# EAGLE design linSen (EAGLE 6.2)
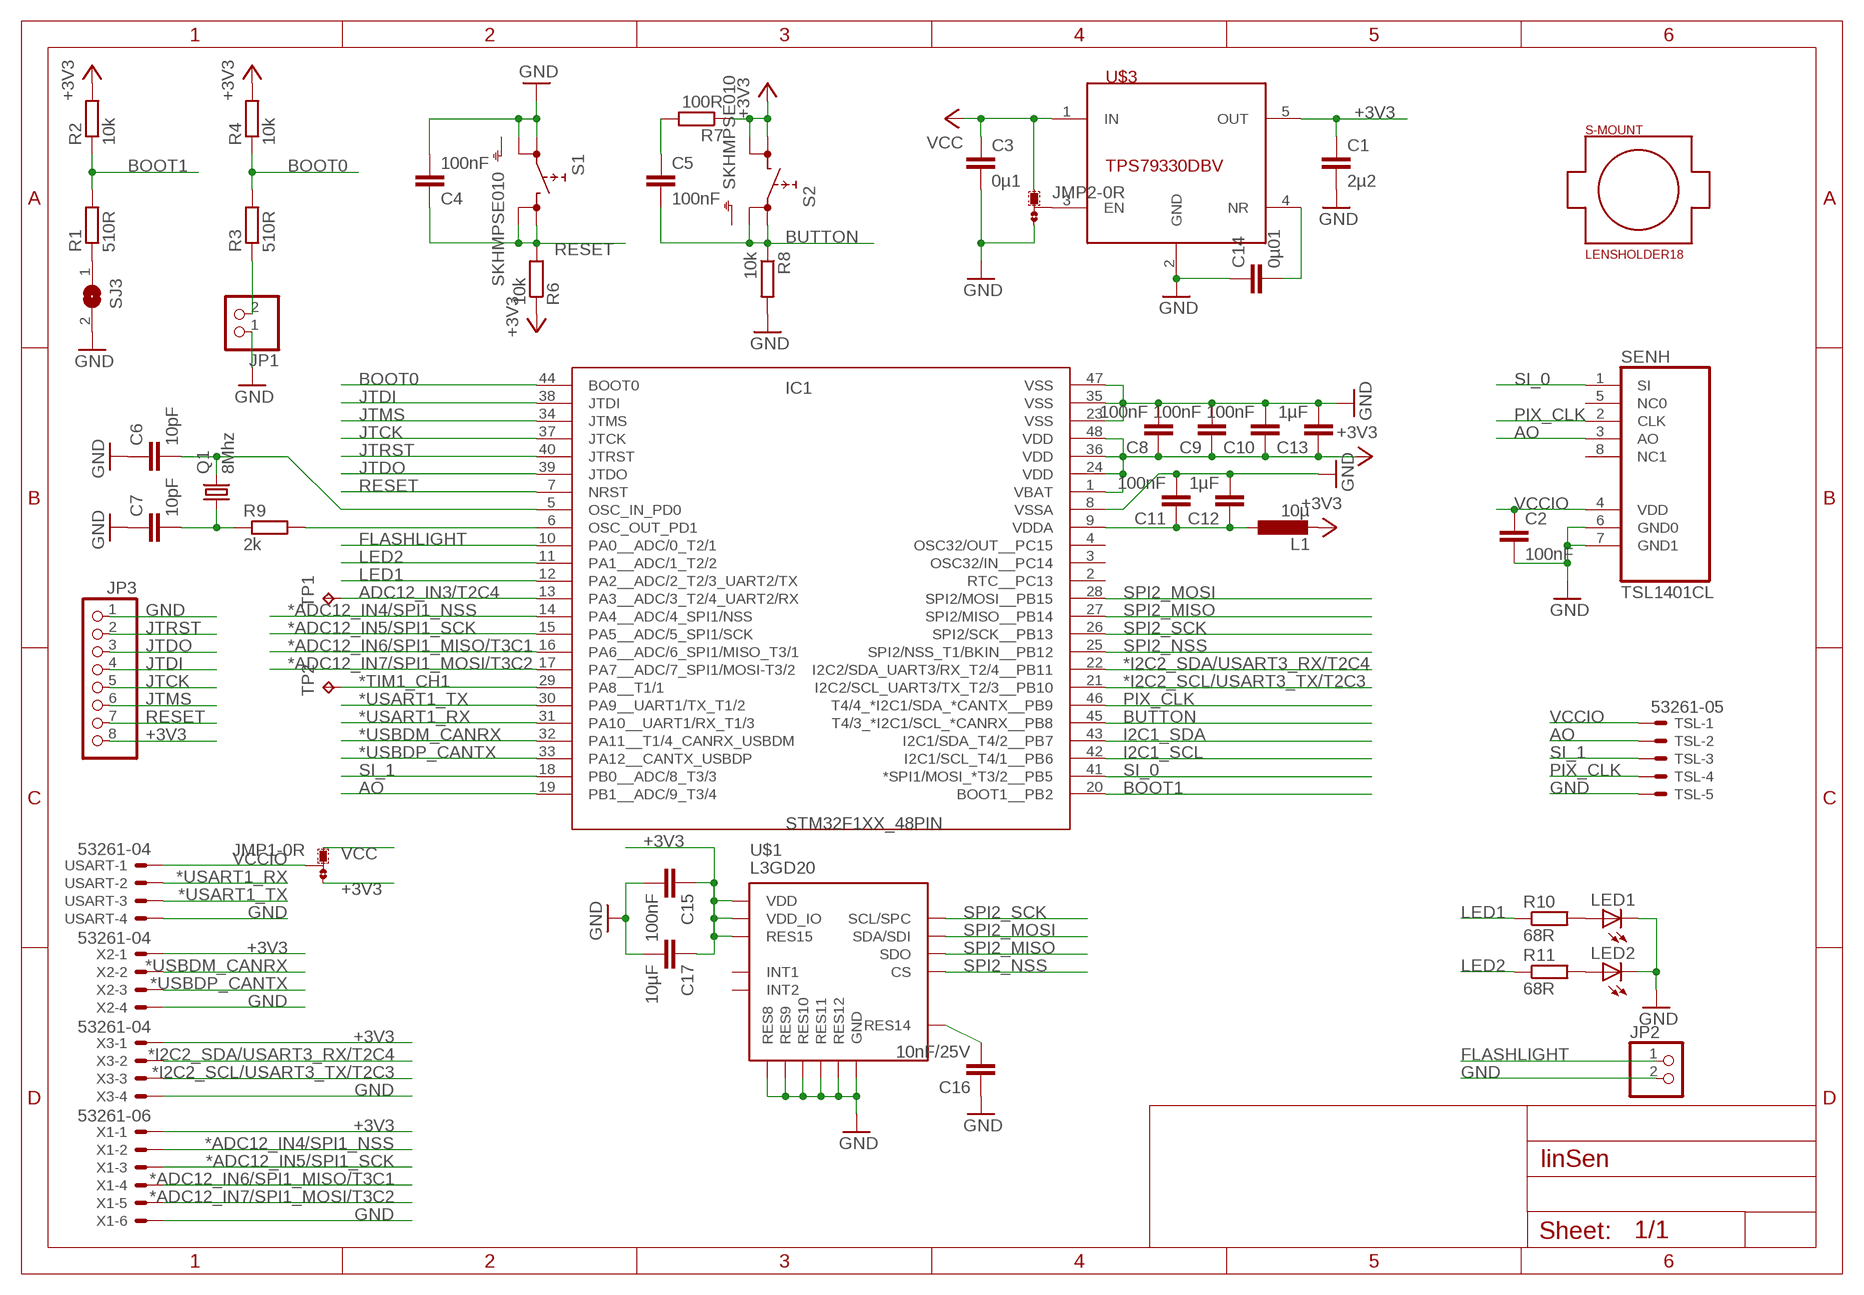
[diagram p0: schematic, sheet 1]

## Parts
C1  2µ2  C-EUC0805  [C0805]
C2  100nF  C-EUC0603  [C0603]
C3  0µ1  C-EUC0603  [C0603]
C4  100nF  C-EUC0603  [C0603]
C5  100nF  C-EUC0603  [C0603]
C6  10pF  C-EUC0603  [C0603]
C7  10pF  C-EUC0603  [C0603]
C8  100nF  C-EUC0603  [C0603]
C9  100nF  C-EUC0603  [C0603]
C10  100nF  C-EUC0603  [C0603]
C11  100nF  C-EUC0603  [C0603]
C12  1µF  C-EUC0603  [C0603]
C13  1µF  C-EUC0603  [C0603]
C14  0µ01  C-EUC0603  [C0603]
C15  100nF  C-EUC0603  [C0603]
C16  10nF/25V  C-EUC0603  [C0603]
C17  10µF  C-EUC0603  [C0603]
IC1  STM32F1XX_48PIN  [LQFP48_PACKAGE]
JMP1  0R-JUMPB  [B0R-JMP]
JMP2  0R-JUMPB  [B0R-JMP]
JP1  PINHD-1X2/90  [1X02/90]
JP2  PINHD-1X2  [1X02]
JP3  PINHD-1X8/SMD  [SMD-PAD-08]
L1  10µ  L-EUL2012C  [L2012C]
LED1  LEDCHIPLED_0603  [CHIPLED_0603]
LED2  LEDCHIPLED_0603  [CHIPLED_0603]
Q1  8Mhz  CRYSTALSM49  [SM49]
R1  510R  R-EU_R0603  [R0603]
R2  10k  R-EU_R0603  [R0603]
R3  510R  R-EU_R0603  [R0603]
R4  10k  R-EU_R0603  [R0603]
R6  10k  R-EU_R0603  [R0603]
R7  100R  R-EU_R0603  [R0603]
R8  10k  R-EU_R0603  [R0603]
R9  2k  R-EU_R0603  [R0603]
R10  68R  R-EU_R0603  [R0603]
R11  68R  R-EU_R0603  [R0603]
S1  SKHMPSE010  [SKHMPXE010]
S2  SKHMPSE010  [SKHMPXE010]
S-MOUNT  LENSHOLDER18  [SMOUNT18]
SENH  TSL1401CL  [TSL1401CL]
SJ3  SJ  [SJ]
TP1  TPB1,27  [B1,27]
TP2  TPB1,27  [B1,27]
TSL  53261-05  [53261-05]
U$1  L3GD20  [LGA-16]
U$3  TPS79330DBV  TPS793XXDBV  [SOT23-5]
USART  53261-04  [53261-04]
X1  53261-06  [53261-06]
X2  53261-04  [53261-04]
X3  53261-04  [53261-04]

## Nets
*ADC12_IN4/SPI1_NSS: IC1.14(PA4__ADC/4_SPI1/NSS) X1.2
*ADC12_IN5/SPI1_SCK: IC1.15(PA5__ADC/5_SPI1/SCK) X1.3
*ADC12_IN6/SPI1_MISO/T3C1: IC1.16(PA6__ADC/6_SPI1/MISO_T3/1) X1.4
*ADC12_IN7/SPI1_MOSI/T3C2: IC1.17(PA7__ADC/7_SPI1/MOSI-T3/2) X1.5
*I2C2_SCL/USART3_TX/T2C3: IC1.21(I2C2/SCL_UART3/TX_T2/3__PB10) X3.3
*I2C2_SDA/USART3_RX/T2C4: IC1.22(I2C2/SDA_UART3/RX_T2/4__PB11) X3.2
*TIM1_CH1: IC1.29(PA8__T1/1) TP2.TP
*USART1_RX: IC1.31(PA10__UART1/RX_T1/3) USART.2
*USART1_TX: IC1.30(PA9__UART1/TX_T1/2) USART.3
*USBDM_CANRX: IC1.32(PA11__T1/4_CANRX_USBDM) X2.2
*USBDP_CANTX: IC1.33(PA12__CANTX_USBDP) X2.3
+3V3: C1.1 C8.1 C9.1 C10.1 C13.1 C15.1 C17.1 IC1.1(VBAT) IC1.24(VDD) IC1.36(VDD) IC1.48(VDD) JMP1.3 JP3.8 L1.2 R2.2 R4.2 R6.1 R7.1 S2.3(2.1) S2.4(2.2) U$1.P$1(VDD_IO) U$1.P$15(RES15) U$1.P$16(VDD) U$3.5(OUT) X1.1 X2.1 X3.1
ADC12_IN3/T2C4: IC1.13(PA3__ADC/3_T2/4_UART2/RX) TP1.TP
AO: IC1.19(PB1__ADC/9_T3/4) SENH.3(AO) TSL.2
BOOT0: IC1.44(BOOT0) R3.2 R4.1
BOOT1: IC1.20(BOOT1__PB2) R1.2 R2.1
BUTTON: C5.2 IC1.45(T4/3_*I2C1/SCL_*CANRX__PB8) R8.1 S2.1(1.1) S2.2(1.2)
FLASHLIGHT: IC1.10(PA0__ADC/0_T2/1) JP2.1
GND: C1.2 C2.2 C3.2 C4.2 C6.1 C7.1 C8.2 C9.2 C10.2 C11.2 C12.2 C13.2 C14.1 C15.2 C16.1 C17.2 IC1.8(VSSA) IC1.23(VSS) IC1.35(VSS) IC1.47(VSS) JMP2.3 JP1.1 JP2.2 JP3.1 LED1.C LED2.C R8.2 S1.1(1.1) S1.2(1.2) SENH.6(GND0) SENH.7(GND1) SJ3.2 TSL.5 U$1.P$8(RES8) U$1.P$9(RES9) U$1.P$10(RES10) U$1.P$11(RES11) U$1.P$12(RES12) U$1.P$13(GND) U$3.2(GND) USART.4 X1.6 X2.4 X3.4
I2C1_SCL: IC1.42(I2C1/SCL_T4/1__PB6)
I2C1_SDA: IC1.43(I2C1/SDA_T4/2__PB7)
JTCK: IC1.37(JTCK) JP3.5
JTDI: IC1.38(JTDI) JP3.4
JTDO: IC1.39(JTDO) JP3.3
JTMS: IC1.34(JTMS) JP3.6
JTRST: IC1.40(JTRST) JP3.2
LED1: IC1.12(PA2__ADC/2_T2/3_UART2/TX) R10.1
LED2: IC1.11(PA1__ADC/1_T2/2) R11.1
N$1: JP1.2 R3.1
N$2: R1.1 SJ3.1
N$3: C6.2 IC1.5(OSC_IN_PD0) Q1.2
N$4: C16.2 U$1.P$14(RES14)
N$5: C7.2 Q1.1 R9.1
N$6: C5.1 R7.2
N$7: IC1.6(OSC_OUT_PD1) R9.2
N$9: C14.2 U$3.4(NR)
N$10: JMP2.2 U$3.3(EN)
N$11: C11.1 C12.1 IC1.9(VDDA) L1.1
N$12: LED1.A R10.2
N$13: LED2.A R11.2
PIX_CLK: IC1.46(T4/4_*I2C1/SDA_*CANTX__PB9) SENH.2(CLK) TSL.4
RESET: C4.1 IC1.7(NRST) JP3.7 R6.2 S1.3(2.1) S1.4(2.2)
SI_0: IC1.41(*SPI1/MOSI_*T3/2__PB5) SENH.1(SI)
SI_1: IC1.18(PB0__ADC/8_T3/3) TSL.3
SPI2_MISO: IC1.27(SPI2/MISO__PB14) U$1.P$4(SDO)
SPI2_MOSI: IC1.28(SPI2/MOSI__PB15) U$1.P$3(SDA/SDI)
SPI2_NSS: IC1.25(SPI2/NSS_T1/BKIN__PB12) U$1.P$5(CS)
SPI2_SCK: IC1.26(SPI2/SCK__PB13) U$1.P$2(SCL/SPC)
VCC: C3.1 JMP1.1 JMP2.1 U$3.1(IN)
VCCIO: C2.1 JMP1.2 SENH.4(VDD) TSL.1 USART.1
Unconnected: IC1.2(RTC__PC13) IC1.3(OSC32/IN__PC14) IC1.4(OSC32/OUT__PC15) S1.5(SH) S2.5(SH) SENH.5(NC0) SENH.8(NC1) U$1.P$6(INT2) U$1.P$7(INT1)

## Library data of the parts
C1-C17 = rcl:C-EU: CAPACITOR, European symbol
IC1 = unsorted:STM32F1XX_48PIN: STM32F1_Low_Med_density_value_LQFP48 edit this description Auto generated by make-symbol-device-package-bsdl.ulp Rev. 32 Source: STM32F1_Low_Med_density_value_LQFP48.bsd
JMP1 JMP2 = jump-0r-smd:0R-JUMP: SMD 0R 0805 Jumper
JP1 JP2 = pinhead:PINHD-1X2: PIN HEADER
JP3 = unsorted:PINHD-1X8: PIN HEADER
L1 = rcl:L-EU: INDUCTOR, European symbol
LED1 LED2 = led:LED: LED OSRAM: - CHIPLED LG R971, LG N971, LY N971, LG Q971, LY Q971, LO R971, LY R971 LH N974, LH R974 LS Q976, LO Q976, LY Q976 LO Q996 - Hyper CHIPLED LW Q18S LB Q993, LB Q99A, LB R99A - SideLED LS A670, LO A670, LY A670, LG A670, LP A670 LB A673, LV A673, LT A673, LW A673 LH A674 LY A675 LS A676, LA A676, LO A676, LY A676, LW A676 LS A679, LY A679, LG A679 - Hyper Micro SIDELED® LS Y876, LA Y876, LO Y876, LY Y876 LT Y87S - SmartLED LW L88C, LW L88S LB L89C, LB L89S, LG L890 LS L89K, LO L89K, LY L89K LS L896, LA L896, LO L896, LY L896 - TOPLED LS T670, LO T670, LY T670, LG T670, LP T670 LSG T670, LSP T670, LSY T670, LOP T670, LYG T670 LG T671, LOG T671, LSG T671 LB T673, LV T673, LT T673, LW T673 LH T674 LS T676, LA T676, LO T676, LY T676, LB T676, LH T676, LSB T676, LW T676 LB T67C, LV T67C, LT T67C, LS T67K, LO T67K, LY T67K, LW E67C LS E67B, LA E67B, LO E67B, LY E67B, LB E67C, LV E67C, LT E67C LW T67C LS T679, LY T679, LG T679 LS T770, LO T770, LY T770, LG T770, LP T770 LB T773, LV T773, LT T773, LW T773 LH T774 LS E675, LA E675, LY E675, LS T675 LS T776, LA T776, LO T776, LY T776, LB T776 LHGB T686 LT T68C, LB T68C - Hyper Mini TOPLED® LB M676 - Mini TOPLED Santana® LG M470 LS M47K, LO M47K, LY M47K Source: http://www.osram.convergy.de LUXEON: - LUMILED® LXK2-PW12-R00, LXK2-PW12-S00, LXK2-PW14-U00, LXK2-PW14-V00 LXK2-PM12-R00, LXK2-PM12-S00, LXK2-PM14-U00 LXK2-PE12-Q00, LXK2-PE12-R00, LXK2-PE12-S00, LXK2-PE14-T00, LXK2-PE14-U00 LXK2-PB12-K00, LXK2-PB12-L00, LXK2-PB12-M00, LXK2-PB14-N00, LXK2-PB14-P00, LXK2-PB14-Q00 LXK2-PR12-L00, LXK2-PR12-M00, LXK2-PR14-Q00, LXK2-PR14-R00 LXK2-PD12-Q00, LXK2-PD12-R00, LXK2-PD12-S00 LXK2-PH12-R00, LXK2-PH12-S00 LXK2-PL12-P00, LXK2-PL12-Q00, LXK2-PL12-R00 Source: www.luxeon.com KINGBRIGHT: KA-3528ASYC Source: www.kingbright.com
Q1 = crystal:CRYSTAL: CRYSTAL; OC_FARNELL: unknown; OC_NEWARK: unknown
R1-R4 R6-R11 = rcl:R-EU_: RESISTOR, European symbol
S1 S2 = switch:SKHMP*E010: 6.2 X 6.5mm TACT Switch (SMD) Source: http://www3.alps.co.jp/WebObjects/catalog.woa/PDF/E/Switch/Tact/SKHM/SKHM.PDF
S-MOUNT = unsorted:LENSHOLDER: S-mount lensholder 12x0.5
SENH = unsorted:TSL1401CL: 128 × 1 LINEAR SENSOR ARRAY WITH HOLD
SJ3 = jumper:SJ: SMD solder JUMPER
TP1 TP2 = testpad:TP: Test pad
TSL = con-molex:53?-05: CONNECTOR wire to board 1.25 mm (.049 inch) pitch header; OC_FARNELL: 1433644; OC_NEWARK: unknown
U$1 = imu:L3GD20: MEMS motion sensor: three-axis digital output gyroscope
U$3 = pwr:TPS793XX: ULTRALOW-NOISE, HIGH PSRR, FAST RF 200mA LOW-DROPOUT LINEAR REGULATORS IN NanoStarTM WAFER CHIP SCALE AND SOT23
USART X2 X3 = con-molex:53?-04: CONNECTOR wire to board 1.25 mm (.049 inch) pitch header; OC_FARNELL: 1125374; OC_NEWARK: unknown
X1 = con-molex:53?-06: CONNECTOR wire to board 1.25 mm (.049 inch) pitch header; OC_FARNELL: 1125375; OC_NEWARK: unknown

## Board
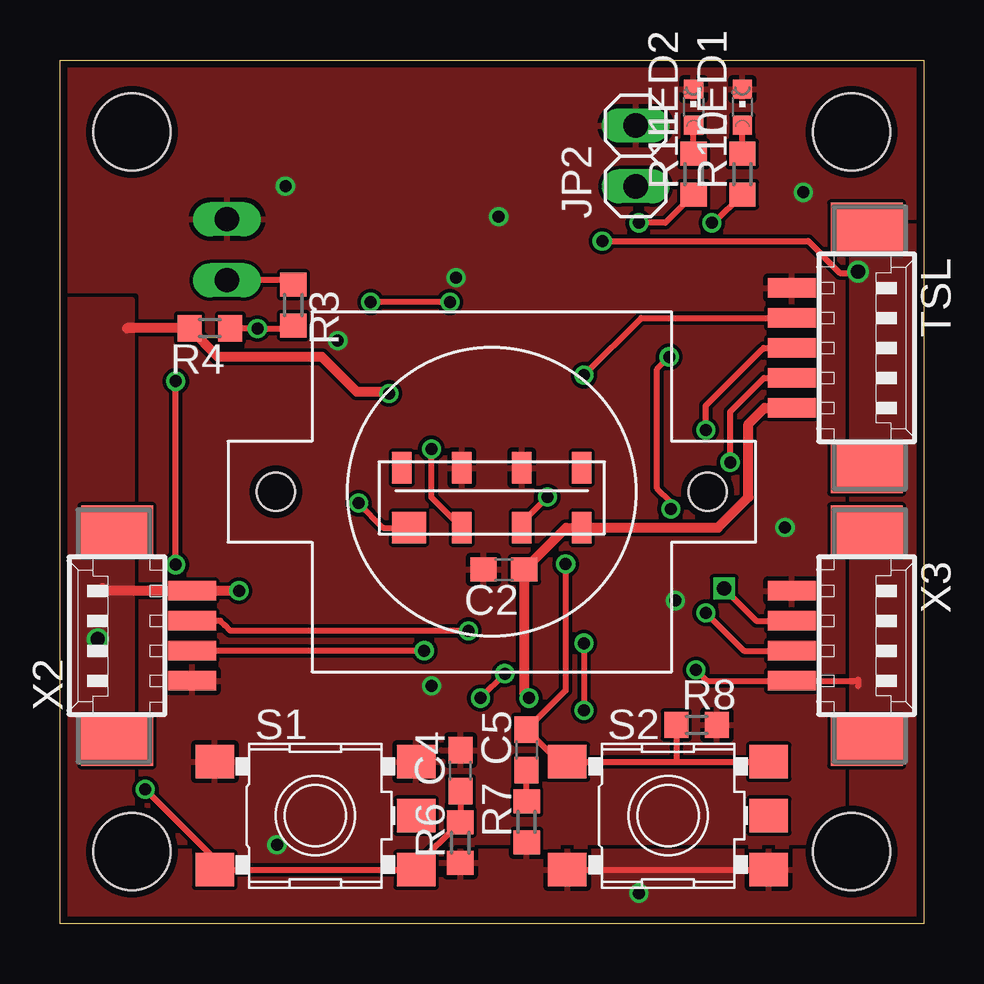
[diagram p1: board, top side]
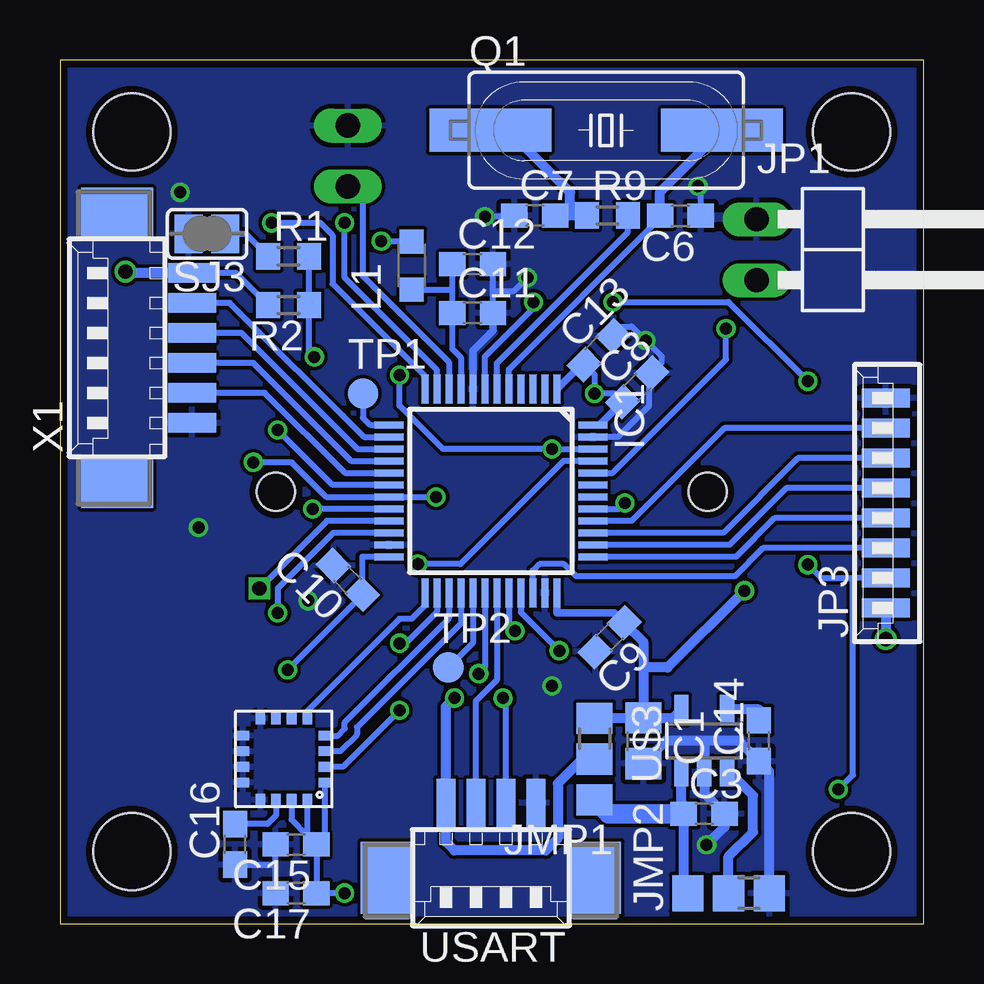
[diagram p2: board, bottom side, seen from below]

Size 36 x 36 mm. Coordinates in mm from the lower left corner, seen from the top.
Outline: 0,36 36,36 36,0 0,0 0,36
Copper layers (1*16): Top 0.035mm / dielectric 1.5mm / Bottom 0.035mm
Design rules: minimum track width 0.15mm, minimum drill 0.3mm, track to track 0.15mm, track to pad 0.15mm, pad to pad 0.15mm, via to via 0.15mm, smd to smd 0.15mm, copper to edge 0.3mm, drill to drill 0.2mm, minimum pad ring 0.2mm, minimum via ring 0.15mm, stop-mask expansion 0.075mm, vias tented up to drill 0mil, thermal gap 0.2mm
Holes 3.2 mm at 3,33 3,3 33,33 33,3

### Footprints (pad centres in the part's own frame; a part is rotated, then mirrored left to right if it is on the bottom)
C0805 = smd 1.3 x 1.5: 1 -0.95,0; 2 0.95,0
C0603 = smd 1.1 x 1: 1 -0.85,0; 2 0.85,0
LQFP48_PACKAGE = smd 1.2 x 0.3: 1 -4.25,2.75; 2 -4.25,2.25; 3 -4.25,1.75; 4 -4.25,1.25; 5 -4.25,0.75; 6 -4.25,0.25; 7 -4.25,-0.25; 8 -4.25,-0.75; 9 -4.25,-1.25; 10 -4.25,-1.75; 11 -4.25,-2.25; 12 -4.25,-2.75; 25 4.25,-2.75; 26 4.25,-2.25; 27 4.25,-1.75; 28 4.25,-1.25; 29 4.25,-0.75; 30 4.25,-0.25; 31 4.25,0.25; 32 4.25,0.75; 33 4.25,1.25; 34 4.25,1.75; 35 4.25,2.25; 36 4.25,2.75 | smd 0.3 x 1.2: 13 -2.75,-4.25; 14 -2.25,-4.25; 15 -1.75,-4.25; 16 -1.25,-4.25; 17 -0.75,-4.25; 18 -0.25,-4.25; 19 0.25,-4.25; 20 0.75,-4.25; 21 1.25,-4.25; 22 1.75,-4.25; 23 2.25,-4.25; 24 2.75,-4.25; 37 2.75,4.25; 38 2.25,4.25; 39 1.75,4.25; 40 1.25,4.25; 41 0.75,4.25; 42 0.25,4.25; 43 -0.25,4.25; 44 -0.75,4.25; 45 -1.25,4.25; 46 -1.75,4.25; 47 -2.25,4.25; 48 -2.75,4.25
B0R-JMP = smd 1.5 x 1.3: 1 0,1.7; 2 0,0; 3 0,-1.7
1X02/90 = drill 1.016 long: 1 -1.27,-3.81; 2 1.27,-3.81
1X02 = drill 1.016 long: 1 -1.27,0; 2 1.27,0
SMD-PAD-08 = smd 0.8 x 2: 1 4.375,-2.5; 2 3.125,-2.5; 3 1.875,-2.5; 4 0.625,-2.5; 5 -0.625,-2.5; 6 -1.875,-2.5; 7 -3.125,-2.5; 8 -4.375,-2.5
L2012C = smd 1 x 1: 1 -1,0; 2 1,0
CHIPLED_0603 = smd 0.8 x 0.8: A 0,-0.75; C 0,0.75
SM49 = smd 5.08 x 1.778: 1 -4.826,0; 2 4.826,0
R0603 = smd 1 x 1.1: 1 -0.85,0; 2 0.85,0
SKHMPXE010 = smd 1.6 x 1.4: 1 -4.2,2.25; 2 4.2,2.25; 3 -4.2,-2.25; 4 4.2,-2.25; 5 4.2,0
SMOUNT18 = hole 1.6: -9,0; 9,0
TSL1401CL = smd 1.3 x 1.4: 1 -1.25,3.45 | smd 1.3 x 0.8: 2 -1.25,1.25; 3 -1.25,-1.25; 4 -1.25,-3.75; 5 1.25,-3.75; 6 1.25,-1.25; 7 1.25,1.25; 8 1.25,3.75
SJ = smd 1.168 x 1.6: 1 -0.762,0; 2 0.762,0
B1,27 = smd 1.27 x 1.27: TP 0,0
53261-05 = smd 0.8 x 2: 1 2.5,-2.5; 2 1.25,-2.5; 3 0,-2.5; 4 -1.25,-2.5; 5 -2.5,-2.5 | smd 2.1 x 3: S1 5,0.625; S2 -5,0.625
LGA-16 = smd 0.5 x 0.4: P$1 -1.7,0.975; P$2 -1.7,0.325; P$3 -1.7,-0.325; P$4 -1.7,-0.975; P$9 1.7,-0.975; P$10 1.7,-0.325; P$11 1.7,0.325; P$12 1.7,0.975 | smd 0.4 x 0.5: P$5 -0.975,-1.7; P$6 -0.325,-1.7; P$7 0.325,-1.7; P$8 0.975,-1.7; P$13 0.975,1.7; P$14 0.325,1.7; P$15 -0.325,1.7; P$16 -0.975,1.7
SOT23-5 = smd 0.6 x 1.2: 1 -0.95,-1.306; 2 0,-1.306; 3 0.95,-1.306; 4 0.95,1.306; 5 -0.95,1.306
53261-04 = smd 0.8 x 2: 1 1.875,-2.5; 2 0.625,-2.5; 3 -0.625,-2.5; 4 -1.875,-2.5 | smd 2.1 x 3: S1 4.375,0.625; S2 -4.375,0.625
53261-06 = smd 0.8 x 2: 1 3.125,-2.5; 2 1.875,-2.5; 3 0.625,-2.5; 4 -0.625,-2.5; 5 -1.875,-2.5; 6 -3.125,-2.5 | smd 2.1 x 3: S1 5.625,0.625; S2 -5.625,0.625

### Placement (x,y rotation side)
C1  11.68,7.62 270 bottom
C2  18.51,14.76 180 top
C3  9.14,4.57 0 bottom
C4  16.69,6.38 90 top
C5  19.46,7.24 90 top
C6  10.13,29.51 180 bottom
C7  16.21,29.51 0 bottom
C8  11.94,22.35 45 bottom
C9  13.08,11.94 225 bottom
C10  24,14.33 135 bottom
C11  18.8,25.45 0 bottom
C12  18.8,27.48 0 bottom
C13  13.54,23.9 45 bottom
C14  6.86,7.62 90 bottom
C15  26.16,3.3 180 bottom
C16  28.7,3.3 90 bottom
C17  26.16,1.27 180 bottom
IC1  18.03,18.03 270 bottom
JMP1  13.72,6.86 180 bottom
JMP2  8.13,1.27 90 bottom
JP1  3.15,28.09 270 bottom
JP2  24,32 90 top
JP3  4.06,17.53 90 bottom
L1  21.34,27.43 90 bottom
LED1  28.45,34.04 0 top
LED2  26.42,34.04 0 top
Q1  13.23,33.07 0 bottom
R1  26.47,27.81 0 bottom
R2  26.47,25.78 180 bottom
R3  9.73,25.78 270 top
R4  6.25,24.82 180 top
R6  16.69,3.38 90 top
R7  19.46,4.24 90 top
R8  26.54,8.28 0 top
R9  13.18,29.51 0 bottom
R10  28.45,31.24 90 top
R11  26.42,31.24 90 top
S1  10.65,4.5 0 top
S2  25.35,4.5 0 top
S-MOUNT  18,18 0 top
SENH  18,17.75 90 top
SJ3  29.87,28.75 180 bottom
TP1  23.37,22.1 0 bottom
TP2  19.81,10.67 0 bottom
TSL  33,24 270 top
U$1  26.67,6.86 180 bottom
U$3  9.14,7.62 0 bottom
USART  18.03,2.54 180 bottom
X1  33,24 90 bottom
X2  3,12 90 top
X3  33,12 270 top

### Tracks (layer width: path | path; a pad name or v marks a point on that pad's centre or on a via)
*ADC12_IN4/SPI1_NSS
  Bottom 0.254: IC1.14 23.33,20.28 28.92,25.88 X1.2
*ADC12_IN5/SPI1_SCK
  Bottom 0.254: IC1.15 23.59,19.78 28.43,24.62 X1.3
*ADC12_IN6/SPI1_MISO/T3C1
  Bottom 0.254: IC1.16 23.86,19.28 27.95,23.38 X1.4
*ADC12_IN7/SPI1_MOSI/T3C2
  Bottom 0.254: IC1.17 24.12,18.78 27.46,22.12 X1.5
*I2C2_SCL/USART3_TX/T2C3  (via drill 0.6)
  Top 0.254: v27.69,13.97 29.03,12.62 X3.3
  Bottom 0.254: IC1.21 24.87,16.78 v27.69,13.97
*I2C2_SDA/USART3_RX/T2C4  (via drill 0.5)
  Top 0.254: v26.92,12.95 28.5,11.38 X3.2
  Bottom 0.254: IC1.22 24.61,16.28 26.92,13.97 v26.92,12.95
*TIM1_CH1
  Bottom 0.254: IC1.29 18.78,11.7 TP2.TP
*USART1_RX
  Bottom 0.254: USART.2 18.66,9.28 17.78,10.16 IC1.31
*USART1_TX  (via drill 0.5)
  Top 0.254: v17.53,9.4 v18.54,10.41
  Bottom 0.254: v17.53,9.4 17.41,9.28 USART.3 | IC1.30 18.28,10.67 v18.54,10.41
*USBDM_CANRX  (via drill 0.5)
  Top 0.254: v17.03,12.2 7.1,12.2 6.86,12.45 6.68,12.62 X2.2
  Bottom 0.254: IC1.32 17.28,12.46 v17.03,12.2
*USBDP_CANTX  (via drill 0.5)
  Top 0.254: v15.19,11.38 X2.3
  Bottom 0.254: IC1.33 16.78,12.97 v15.19,11.38
+3V3  (via drill 0.5, 0.6)
  Top 0.254: S2.3 S2.4 | 13.65,22.16 v13.72,22.1 | v26.51,10.57 26.97,10.11 X3.1 | X3.1 | X3.1 33.27,10.11 33.27,10.16 33.27,9.91 | v22.61,28.45 31.19,28.45 32.51,27.12 33.22,27.12 v33.27,27.18
  Top 0.406: 2.79,24.82 R4.2 6.59,23.62 10.92,23.62 12.38,22.16 13.65,22.16 | v7.46,13.88 X2.1 1.78,13.88 1.78,13.97
  Bottom 0.254: 11.7,8.56 C1.1 | 23.4,15.28 23.4,15.24 | 14.27,23.3 C13.1 13.72,22.88 v13.72,22.1 12.89,22.1 C8.1 | IC1.48 13.51,20.78 | IC1.24 23.36,15.28 23.4,15.24 | 23.4,15.24 C10.1 | C10.1 | v22.61,28.45 21.34,28.45 L1.2 | C10.1 23.4,13.68 v26.51,10.57 | v1.56,11.86 v1.57,11.86 | U$1.P$15 26.34,4.33 25.7,3.69 | U$1.P$16 25.7,3.69 | 25.7,3.69 C15.1 | U$1.P$1 24.97,3.64 C15.1 | C15.1 C17.1 v24.13,1.27 | R2.2 28.66,27.12 X1.1
  Bottom 0.305: IC1.1 14.27,23.3 | 13.51,20.78 C8.1 | IC1.36 15.28,12.95 12.89,12.95 C9.1 | C9.1
  Bottom 0.406: U$3.5 10.45,8.57 C1.1 11.68,10.67 | 11.7,8.56 JMP1.3 | JP3.8 v1.56,11.86 | C9.1 11.68,11.74 11.68,10.67 | 11.68,10.67 10.67,10.67 v7.46,13.88 | X1.1 33.22,27.12 v33.27,27.18
  pour Top: 0,26 0,0 36,0 36,29.05 33,29.05 33,3 3,3 3,26
ADC12_IN3/T2C4
  Bottom 0.254: TP1.TP 23.37,21.08 23.07,20.78 IC1.13
AO  (via drill 0.5)
  Top 0.254: 19.25,16.96 SENH.3 19.25,16.71 v20.32,17.78 | v27.94,19.23 27.94,21.34 29.21,22.61 29.35,22.75 TSL.2
  Bottom 0.254: v27.94,19.23 26.34,19.23 24.9,17.78 IC1.19 v20.32,17.78
BOOT0  (via drill 0.5)
  Top 0.254: 7.1,24.8 v8.23,24.8 9.73,24.8
  Top 0.406: 7.1,24.8 R4.1 | 9.73,24.8 R3.2
  Bottom 0.254: IC1.44 12.97,18.78 8.23,23.52 v8.23,24.8
BOOT1  (via drill 0.5)
  Top 0.254: v25.4,23.62 24.89,23.11 24.89,18.14 25.46,17.57 v25.46,17.28
  Bottom 0.254: R1.2 R2.1 25.62,23.84 v25.4,23.62 | IC1.20 v25.46,17.28
BUTTON  (via drill 0.5)
  Top 0.254: 25.69,6.75 S2.1 20.8,6.75 C5.2 21.08,9.71 v21.08,14.99 | 25.69,6.75 S2.2 | R8.1 25.69,6.75
  Bottom 0.254: IC1.45 15.01,19.28 19.3,14.99 v21.08,14.99
FLASHLIGHT
  Bottom 0.254: JP2.1 23.37,30.1 23.37,26.99 19.78,23.4 IC1.10
GND  (via drill 0.5)
  Bottom 0.254: C11.2 17.95,26.36 | 17.95,26.36 C12.2 | v9.4,30.73 9.29,30.62 C6.1 | USART.4 | 11.43,22.86 11.43,21.59 12.74,20.28 IC1.47 | v16.51,26.92 17.07,26.36 17.95,26.36 | C7.1 17.11,29.46 v18.29,29.46 | 13.13,24.31 13.13,24.64 | C13.2 12.94,24.89 12.17,24.89 v11.58,24.31 10.92,23.65 10.92,23.37 C8.2 | C17.2 27.01,2.45 | 27.01,2.45 C15.2 | C16.1 27.01,2.45
  Bottom 0.305: C11.2 17.95,24.73 18.78,23.89 IC1.8
  Bottom 0.406: 9.14,7.62 U$3.2 9.14,5.42 C3.2 8.29,4.03 v9.04,3.28 | 9.14,7.62 10.73,7.62 C1.2 | 9.14,7.62 7.71,7.62 C14.1 6.43,6.34 JMP2.3
  other vias: 30.99,30.48 30.23,16.51 15.49,9.91 25.65,13.46
  pour Top (rank 2): 0,36.07 36.07,36.07 36.07,0 0,0
  pour Bottom: 0,36.07 36.07,36.07 36.07,0 0,0
JTCK
  Bottom 0.254: JP3.5 6.21,16.9 7.83,15.28 IC1.37
JTDI
  Bottom 0.254: JP3.4 5.72,18.15 8.09,15.78 IC1.38
JTDO
  Bottom 0.254: JP3.3 5.24,19.4 8.35,16.28 IC1.39
JTMS
  Bottom 0.254: IC1.34 16.28,14.74 16.25,14.74 16,14.99 14.99,14.99 14.48,14.48 7.87,14.48 6.7,15.65 JP3.6
JTRST
  Bottom 0.254: JP3.2 8.3,20.65 12.17,16.78 IC1.40
LED1  (via drill 0.5)
  Top 0.254: R10.1 27.27,29.21 v27.18,29.21
  Bottom 0.254: v27.18,29.21 25.15,29.21 24.64,28.7 24.64,26.67 20.78,22.82 IC1.12
LED2  (via drill 0.5)
  Top 0.254: R11.1 25.23,29.21 v24.13,29.21
  Bottom 0.254: IC1.11 20.28,23.08 24.13,26.92 v24.13,29.21
N$1
  Top 0.254: R3.1 9.54,26.82 JP1.2
N$2
  Bottom 0.254: SJ3.1 28.26,28.75 R1.1
N$3
  Bottom 0.254: 11.41,29.52 C6.2 11.04,29.46 11.18,29.46 11.18,29.21 17.28,23.1 IC1.5
  Bottom 0.406: Q1.2 10.98,30.49 C6.2
N$4
  Bottom 0.254: U$1.P$14 27,4.5 27.34,4.15 C16.2
N$5
  Bottom 0.406: R9.1 14.73,29.52 | 14.73,29.52 C7.2 | Q1.1 17.32,33.07 14.73,30.48 14.73,29.52
N$6
  Top 0.254: R7.2 C5.1
N$7
  Bottom 0.254: R9.2 12.33,28.82 17.78,23.36 IC1.6
N$9
  Bottom 0.406: U$3.4 6.86,8.93 C14.2
N$10
  Bottom 0.406: U$3.3 8.09,6.31 7.11,5.33 7.11,3.81 8.13,2.79 JMP2.2
N$11
  Bottom 0.254: C12.1 19.65,26.43 | L1.1 19.65,26.43 | 19.65,26.43 C11.1 19.65,23.96 19.28,23.6 IC1.9
N$12
  Top 0.254: R10.2 LED1.A
N$13
  Top 0.254: R11.2 LED2.A
PIX_CLK  (via drill 0.5)
  Top 0.254: SENH.2 15.48,17.76 | 15.48,17.76 15.49,17.76 | 15.48,17.76 v15.48,19.78 | v21.84,22.86 24.23,25.25 TSL.4
  Bottom 0.254: v21.84,22.86 21.84,21.59 20.04,19.78 v15.48,19.78 IC1.46
RESET  (via drill 0.5)
  Top 0.254: v4.83,14.96 v4.83,22.61 | C4.1 R6.2 16.67,4.23 14.85,2.4 S1.4 S1.3 6.45,2.69 v3.56,5.59 | v16.26,25.91 v12.95,25.91
  Bottom 0.254: IC1.7 18.28,23.63 16.26,25.65 v16.26,25.91 | v12.95,25.91 8.13,25.91 v4.83,22.61 | JP3.7 2.95,14.4 | v3.56,5.59 2.95,6.2 2.95,14.4 | v4.83,14.96 4.27,14.4 2.95,14.4
SI_0  (via drill 0.5)
  Top 0.254: v12.45,17.53 13.48,16.5 SENH.1
  Bottom 0.254: IC1.41 12.69,17.28 v12.45,17.53
SI_1  (via drill 0.5)
  Top 0.254: v26.92,20.57 26.92,21.59 29.21,23.88 29.33,24 TSL.3
  Bottom 0.254: IC1.18 24.63,18.28 v26.92,20.57
SPI2_MISO
  Bottom 0.254: IC1.27 19.78,12.73 24.13,8.38 24.13,8.13 24.43,7.83 U$1.P$4
SPI2_MOSI
  Bottom 0.254: IC1.28 19.28,12.52 23.62,8.18 23.62,7.87 24.31,7.18 U$1.P$3
SPI2_NSS
  Bottom 0.254: U$1.P$5 25.7,8.85 21.84,12.7 21.34,12.7 20.78,13.25 IC1.25
SPI2_SCK  (via drill 0.5)
  Top 0.254: v21.84,11.68 v21.84,8.89
  Bottom 0.254: IC1.26 20.28,12.99 21.59,11.68 v21.84,11.68 | v21.84,8.89 24.2,6.53 U$1.P$2
VCC
  Bottom 0.406: U$3.1 10.09,4.67 C3.1 9.99,1.44 JMP2.1
  Bottom 0.813: JMP1.1 13.13,4.57 C3.1
VCCIO  (via drill 0.5)
  Top 0.406: 21.57,16.51 21.76,16.51 | v19.56,9.4 19.36,9.6 C2.1 21.1,16.5 SENH.4 21.76,16.51 | 21.76,16.51 27.43,16.51 28.7,17.78 28.7,20.83 29.21,21.34 29.37,21.5 TSL.1
  Bottom 0.254: JMP1.2 14.22,6.86
  Bottom 0.406: 14.22,6.86 15.24,5.84 15.24,3.56 15.75,3.05 19.56,3.05 19.91,3.4 USART.1 19.91,9.05 v19.56,9.4